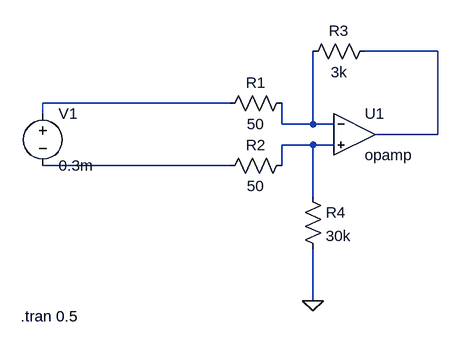
[diagram p0: schematic LoadCell.asc]
LoadCell.asc, the LTspice schematic file:
Version 4
SHEET 1 880 680
WIRE 592 0 480 0
WIRE 272 80 -16 80
WIRE -16 96 -16 80
WIRE 352 112 352 80
WIRE 400 112 400 0
WIRE 400 112 352 112
WIRE 432 112 400 112
WIRE 592 128 592 0
WIRE 592 128 496 128
WIRE 400 144 352 144
WIRE 432 144 400 144
WIRE 272 176 -16 176
WIRE 352 176 352 144
WIRE 400 224 400 144
WIRE 400 384 400 304
FLAG 400 384 0
SYMBOL voltage -16 80 R0
WINDOW 123 0 0 Left 2
WINDOW 39 0 0 Left 2
SYMATTR InstName V1
SYMATTR Value 0.3m
SYMBOL res 368 64 R90
WINDOW 0 0 56 VBottom 2
WINDOW 3 32 56 VTop 2
SYMATTR InstName R1
SYMATTR Value 50
SYMBOL res 368 160 R90
WINDOW 0 0 56 VBottom 2
WINDOW 3 32 56 VTop 2
SYMATTR InstName R2
SYMATTR Value 50
SYMBOL res 496 -16 R90
WINDOW 0 0 56 VBottom 2
WINDOW 3 32 56 VTop 2
SYMATTR InstName R3
SYMATTR Value 3k
SYMBOL res 384 208 R0
SYMATTR InstName R4
SYMATTR Value 30k
SYMBOL Opamps\\opamp 464 64 R0
SYMATTR InstName U1
TEXT -50 408 Left 2 !.tran 0.5

The netlist it stands for:
* LoadCell.asc
V1 N002 N005 0.3m
R1 N003 N002 50
R2 N004 N005 50
R3 N001 N003 3k
R4 N004 0 30k
XU1 N003 N004 N001 opamp Aol=100K GBW=10Meg  ; pins invin noninvin out
.tran 0.5
.backanno
.end